# EAGLE schematic light_bulb_PCB (EAGLE 9.2.1)
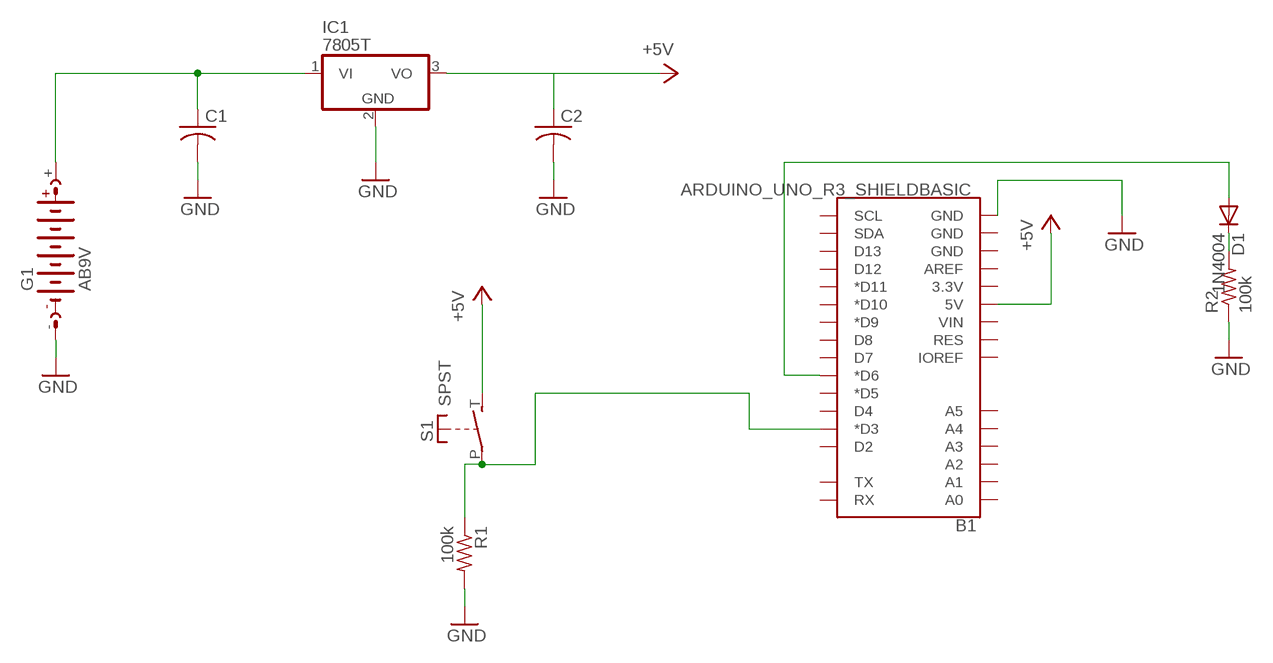
[diagram p0: schematic, sheet 1]

## Parts
B1  ARDUINO_UNO_R3_SHIELDBASIC  [UNO_R3_SHIELD]
C1  0.1  C-USC0805  [C0805]
C2  0.1  C-USC0805  [C0805]
D1  1N4004  [DO41-10]
G1  AB9V  [AB9V]
IC1  7805T  [TO220H]
R1  100k  R-US_R0805  [R0805]
R2  100k  R-US_R0805  [R0805]
S1  SPST  [JUDCOSPST]

## Nets
+5V: B1.5V C2.1 IC1.3(VO) S1.T(S)
GND: B1.GND@0(GND) C1.2 C2.2 G1.- IC1.2(GND) R1.2 R2.1
N$1: C1.1 G1.+ IC1.1(VI)
N$2: D1.C R2.2
N$4: B1.D3(*D3) R1.1 S1.P
N$6: B1.D6(*D6) D1.A
Unconnected: B1.3.3V B1.A0 B1.A1 B1.A2 B1.A3 B1.A4 B1.A5 B1.AREF B1.D2 B1.D4 B1.D5(*D5) B1.D7 B1.D8 B1.D9(*D9) B1.D10(*D10) B1.D11(*D11) B1.D12 B1.D13 B1.GND@1(GND) B1.GND@2(GND) B1.IOREF B1.RES B1.RX B1.SCL B1.SDA B1.TX B1.VIN

## Library data of the parts
B1 = SparkFun-Boards:ARDUINO_UNO_R3_SHIELD: Arduino R3 Shield Footprint Shield form compatible with the Arduino Uno R3. SparkFun Products: MG2639 Cellular Shield <https://www.sparkfun.com/products/13120> MIDI Shield <https://www.sparkfun.com/products/12898> R3 Stackable Headers Kit <https://www.sparkfun.com/products/11417>
C1 C2 = adafruit:C-US: CAPACITOR, American symbol
D1 = diode:1N4004: DIODE general purpose rectifier, 1 A
G1 = battery:AB9V: 9-V BATTERY CLIP
IC1 = adafruit:78*: Positive VOLTAGE REGULATOR Added bigger pads to the TO-92 package
R1 R2 = adafruit:R-US_: RESISTOR, American symbol
S1 = adafruit:SPST: Judco 50-0015-00

## Net classes
0 default: width 0.305 mm, drill 0.508 mm, clearance 0.305 mm